# EAGLE design dababa (EAGLE 9.6.2)
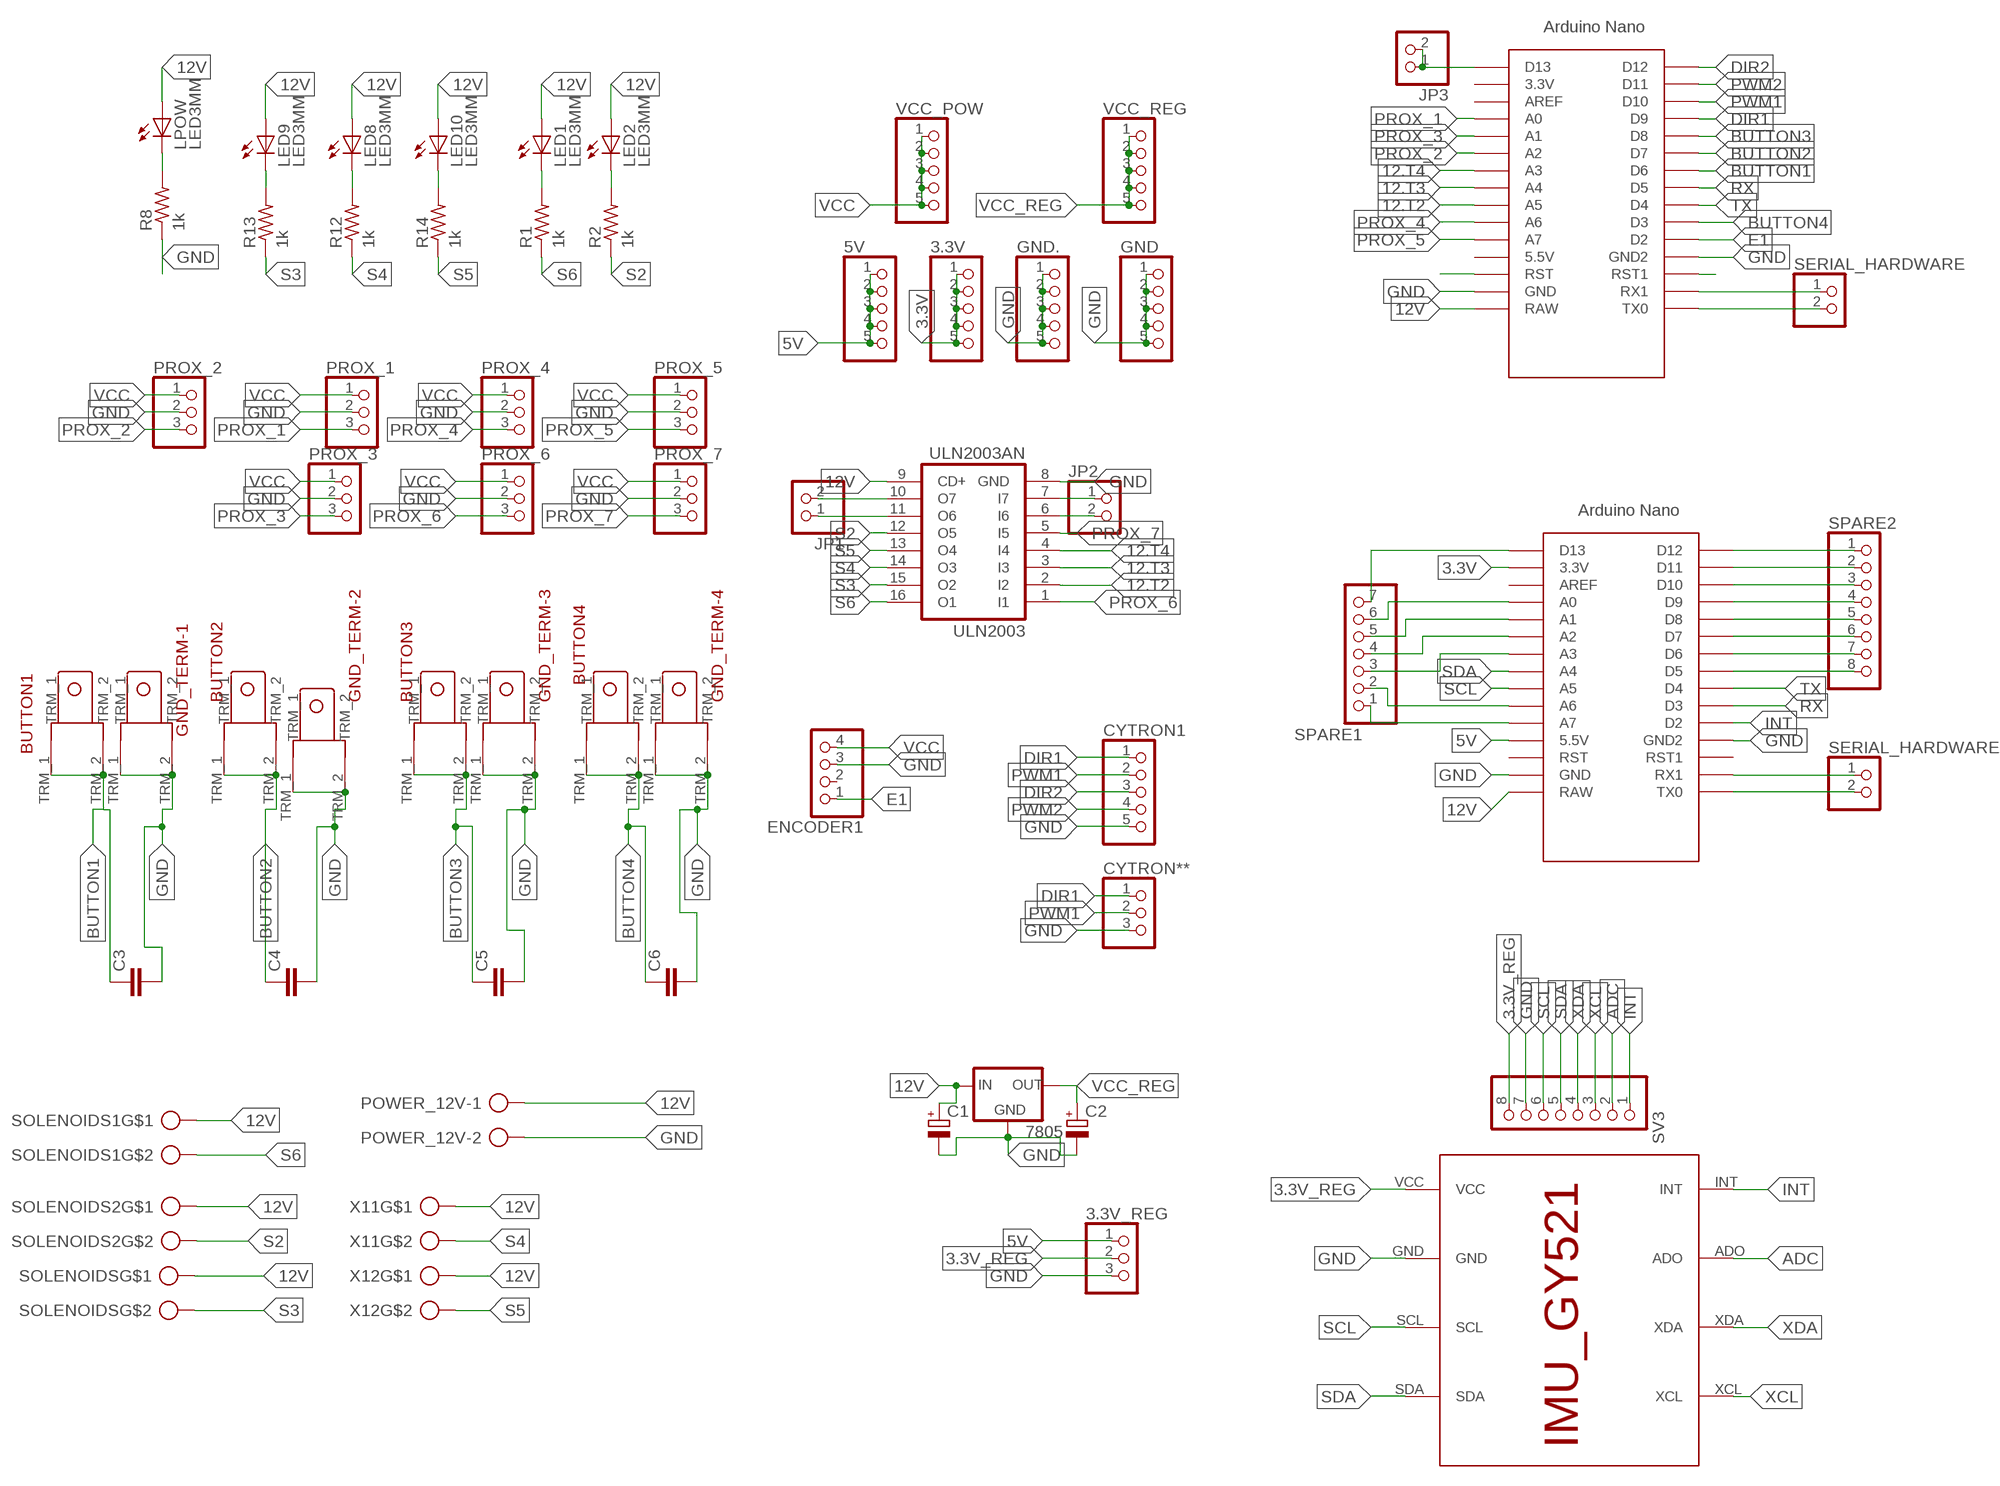
[diagram p0: schematic, sheet 1]

## Parts
3.3V  PINHD-1X5  [1X05]
3.3V_REG  PINHD-1X3  [1X03]
5V  PINHD-1X5  [1X05]
7805  78XXS  [78XXS]
BUTTON1  TERMINAL_EDITED  [TERMINAL_EDITED]
BUTTON2  TERMINAL_EDITED  [TERMINAL_EDITED]
BUTTON3  TERMINAL_EDITED  [TERMINAL_EDITED]
BUTTON4  TERMINAL_EDITED  [TERMINAL_EDITED]
C1  CAP_POL  [E3,5-8]
C2  CAP_POL  [E3,5-8]
C3  CAPACITOR  [C025-025X050]
C4  CAPACITOR  [C025-025X050]
C5  CAPACITOR  [C025-025X050]
C6  CAPACITOR  [C025-025X050]
CYTRON1  PINHD-1X5  [1X05]
CYTRON**  PINHD-1X3  [1X03]
ENCODER1  PINHD-1X4  [1X04]
GND  PINHD-1X5  [1X05]
GND.  PINHD-1X5  [1X05]
GND_TERM-1  TERMINAL_EDITED  [TERMINAL_EDITED]
GND_TERM-2  TERMINAL_EDITED  [TERMINAL_EDITED]
GND_TERM-3  TERMINAL_EDITED  [TERMINAL_EDITED]
GND_TERM-4  TERMINAL_EDITED  [TERMINAL_EDITED]
JP1  PINHD-1X2  [1X02]
JP2  PINHD-1X2  [1X02]
JP3  PINHD-1X2  [1X02]
LED1  LED3MM  [LED3MM]
LED2  LED3MM  [LED3MM]
LED8  LED3MM  [LED3MM]
LED9  LED3MM  [LED3MM]
LED10  LED3MM  [LED3MM]
LPOW  LED3MM  [LED3MM]
POWER_12V  ROSTA.POWER  [W239-302]
PROX_1  PINHD-1X3  [1X03]
PROX_2  PINHD-1X3  [1X03]
PROX_3  PINHD-1X3  [1X03]
PROX_4  PINHD-1X3  [1X03]
PROX_5  PINHD-1X3  [1X03]
PROX_6  PINHD-1X3  [1X03]
PROX_7  PINHD-1X3  [1X03]
R1  1k  RES-5  [0204/5]
R2  1k  RES-5  [0204/5]
R8  1k  RES-5  [0204/5]
R12  1k  RES-5  [0204/5]
R13  1k  RES-5  [0204/5]
R14  1k  RES-5  [0204/5]
SERIAL_HARDWARE  PINHD-1X2  [1X02]
SERIAL_HARDWARE1  PINHD-1X2  [1X02]
SOLENOIDS  CON_PTR_2  [AK300/2]
SOLENOIDS1  CON_PTR_2  [AK300/2]
SOLENOIDS2  CON_PTR_2  [AK300/2]
SPARE1  PINHD-1X7  [1X07]
SPARE2  PINHD-1X8  [1X08]
SV3  PINHD-1X8  [1X08]
U$1  ARDUINO_NANO  [NANO]
U$2  IMU_ROBOCON_GY521  [IMU_GY521]
U$4  ARDUINO_NANO  [NANO]
ULN2003  ULN2003AN  [DIL16]
VCC_POW  PINHD-1X5  [1X05]
VCC_REG  PINHD-1X5  [1X05]
X11  CON_PTR_2  [AK300/2]
X12  CON_PTR_2  [AK300/2]

## Nets
3.3V: 3.3V.1 3.3V.2 3.3V.3 3.3V.4 3.3V.5 U$4.3.3V
3.3V_REG: 3.3V_REG.2 SV3.8 U$2.VCC
5V: 3.3V_REG.1 5V.1 5V.2 5V.3 5V.4 5V.5 U$4.5V(5.5V)
12.T2: U$1.A5 ULN2003.2(I2)
12.T3: U$1.A4 ULN2003.3(I3)
12.T4: U$1.A3 ULN2003.4(I4)
12V: 7805.IN C1.+ LED1.A LED2.A LED8.A LED9.A LED10.A LPOW.A POWER_12V.1 SOLENOIDS1.1 SOLENOIDS2.1 SOLENOIDS.1 U$1.RAW U$4.RAW ULN2003.9(CD+) X11.1 X12.1
ADC: SV3.2 U$2.ADO
BUTTON1: BUTTON1.TRM_1 BUTTON1.TRM_2 C3.1 U$1.D6
BUTTON2: BUTTON2.TRM_1 BUTTON2.TRM_2 C4.1 U$1.D7
BUTTON3: BUTTON3.TRM_1 BUTTON3.TRM_2 C5.1 U$1.D8
BUTTON4: BUTTON4.TRM_1 BUTTON4.TRM_2 C6.1 U$1.D3
DIR1: CYTRON1.1 CYTRON**.1 U$1.D9
DIR2: CYTRON1.3 U$1.D12
E1: ENCODER1.1 U$1.D2
GND: 3.3V_REG.3 7805.GND C1.- C2.- C3.2 C4.2 C5.2 C6.2 CYTRON1.5 CYTRON**.3 ENCODER1.3 GND.1 GND.2 GND.3 GND.4 GND.5 GND..1 GND..2 GND..3 GND..4 GND..5 GND_TERM-1.TRM_1 GND_TERM-1.TRM_2 GND_TERM-2.TRM_1 GND_TERM-2.TRM_2 GND_TERM-3.TRM_1 GND_TERM-3.TRM_2 GND_TERM-4.TRM_1 GND_TERM-4.TRM_2 POWER_12V.2 PROX_1.2 PROX_2.2 PROX_3.2 PROX_4.2 PROX_5.2 PROX_6.2 PROX_7.2 R8.1 SV3.7 U$1.GND U$1.GND1(GND2) U$2.GND U$4.GND U$4.GND1(GND2) ULN2003.8(GND)
INT: SV3.1 U$2.INT U$4.D2
N$1: SERIAL_HARDWARE.1 U$1.RX1
N$2: SERIAL_HARDWARE.2 U$1.TX0
N$4: LED1.K(C) R1.2
N$5: LED2.K(C) R2.2
N$7: JP1.1 ULN2003.11(O6)
N$8: JP1.2 ULN2003.10(O7)
N$9: JP2.1 ULN2003.7(I7)
N$10: JP2.2 ULN2003.6(I6)
N$11: LPOW.K(C) R8.2
N$12: LED8.K(C) R12.2
N$13: U$1.RST1
N$15: JP3.1 JP3.2 U$1.D13
N$16: LED9.K(C) R13.2
N$19: LED10.K(C) R14.2
N$21: SERIAL_HARDWARE1.1 U$4.RX1
N$28: U$1.RST
N$33: SERIAL_HARDWARE1.2 U$4.TX0
N$39: SPARE1.3 U$4.A3
N$42: SPARE1.1 U$4.A7
N$43: SPARE1.2 U$4.A6
N$47: SPARE1.4 U$4.A2
N$48: SPARE1.5 U$4.A1
N$49: SPARE1.6 U$4.A0
N$52: SPARE1.7 U$4.D13
N$53: SPARE2.1 U$4.D12
N$54: SPARE2.2 U$4.D11
N$55: SPARE2.3 U$4.D10
N$56: SPARE2.4 U$4.D9
N$57: SPARE2.5 U$4.D8
N$58: SPARE2.6 U$4.D7
N$59: SPARE2.7 U$4.D6
N$60: SPARE2.8 U$4.D5
PROX_1: PROX_1.3 U$1.A0
PROX_2: PROX_2.3 U$1.A2
PROX_3: PROX_3.3 U$1.A1
PROX_4: PROX_4.3 U$1.A6
PROX_5: PROX_5.3 U$1.A7
PROX_6: PROX_6.3 ULN2003.1(I1)
PROX_7: PROX_7.3 ULN2003.5(I5)
PWM1: CYTRON1.2 CYTRON**.2 U$1.D10
PWM2: CYTRON1.4 U$1.D11
RX: U$1.D5 U$4.D3
S2: R2.1 SOLENOIDS2.2 ULN2003.12(O5)
S3: R13.1 SOLENOIDS.2 ULN2003.15(O2)
S4: R12.1 ULN2003.14(O3) X11.2
S5: R14.1 ULN2003.13(O4) X12.2
S6: R1.1 SOLENOIDS1.2 ULN2003.16(O1)
SCL: SV3.6 U$2.SCL U$4.A5
SDA: SV3.5 U$2.SDA U$4.A4
TX: U$1.D4 U$4.D4
VCC: ENCODER1.4 PROX_1.1 PROX_2.1 PROX_3.1 PROX_4.1 PROX_5.1 PROX_6.1 PROX_7.1 VCC_POW.1 VCC_POW.2 VCC_POW.3 VCC_POW.4 VCC_POW.5
VCC_REG: 7805.OUT C2.+ VCC_REG.1 VCC_REG.2 VCC_REG.3 VCC_REG.4 VCC_REG.5
XCL: SV3.3 U$2.XCL
XDA: SV3.4 U$2.XDA
Unconnected: ENCODER1.2 U$1.3.3V U$1.5V(5.5V) U$1.AREF U$4.AREF U$4.RST U$4.RST1

## Library data of the parts
3.3V 5V CYTRON1 GND GND. VCC_POW VCC_REG = MIA_LIBRARY-2-2-2:PINHD-1X5: PIN HEADER
3.3V_REG CYTRON** PROX_1-PROX_7 = MIA_LIBRARY-2-2-2:PINHD-1X3: PIN HEADER
7805 = MIA_LIBRARY-2-2-2:78XXS: VOLTAGE REGULATOR
BUTTON1-BUTTON4 GND_TERM-1-GND_TERM-4 = MIA_LIBRARY-2-2-2:TERMINAL_EDITED
C1 C2 = MIA_LIBRARY-2-2-2:CAP_POL
C3-C6 = MIA_LIBRARY-2-2-2:CAPACITOR
ENCODER1 = MIA_LIBRARY-2-2-2:PINHD-1X4: PIN HEADER
JP1-JP3 SERIAL_HARDWARE SERIAL_HARDWARE1 = MIA_LIBRARY-2-2-2:PINHD-1X2: PIN HEADER
LED1 LED2 LED8-LED10 LPOW = MIA_LIBRARY-2-2-2:LED3MM
POWER_12V = MIA_LIBRARY-2-2-2:ROSTA.POWER: WAGO SCREW CLAMP; OC_FARNELL: unknown; OC_NEWARK: unknown
R1 R2 R8 R12-R14 = MIA_LIBRARY-2-2-2:RES-5
SOLENOIDS SOLENOIDS1 SOLENOIDS2 X11 X12 = MIA_LIBRARY-2-2-2:CON_PTR_2
SPARE1 = MIA_LIBRARY-2-2-2:PINHD-1X7: PIN HEADER
SPARE2 SV3 = MIA_LIBRARY-2-2-2:PINHD-1X8: PIN HEADER
U$1 U$4 = MIA_LIBRARY-2-2-2:ARDUINO_NANO: Arduino Nano
U$2 = MIA_LIBRARY-2-2-2:IMU_ROBOCON_GY521
ULN2003 = MIA_LIBRARY-2-2-2:ULN2003A: DRIVER ARRAY

## Board
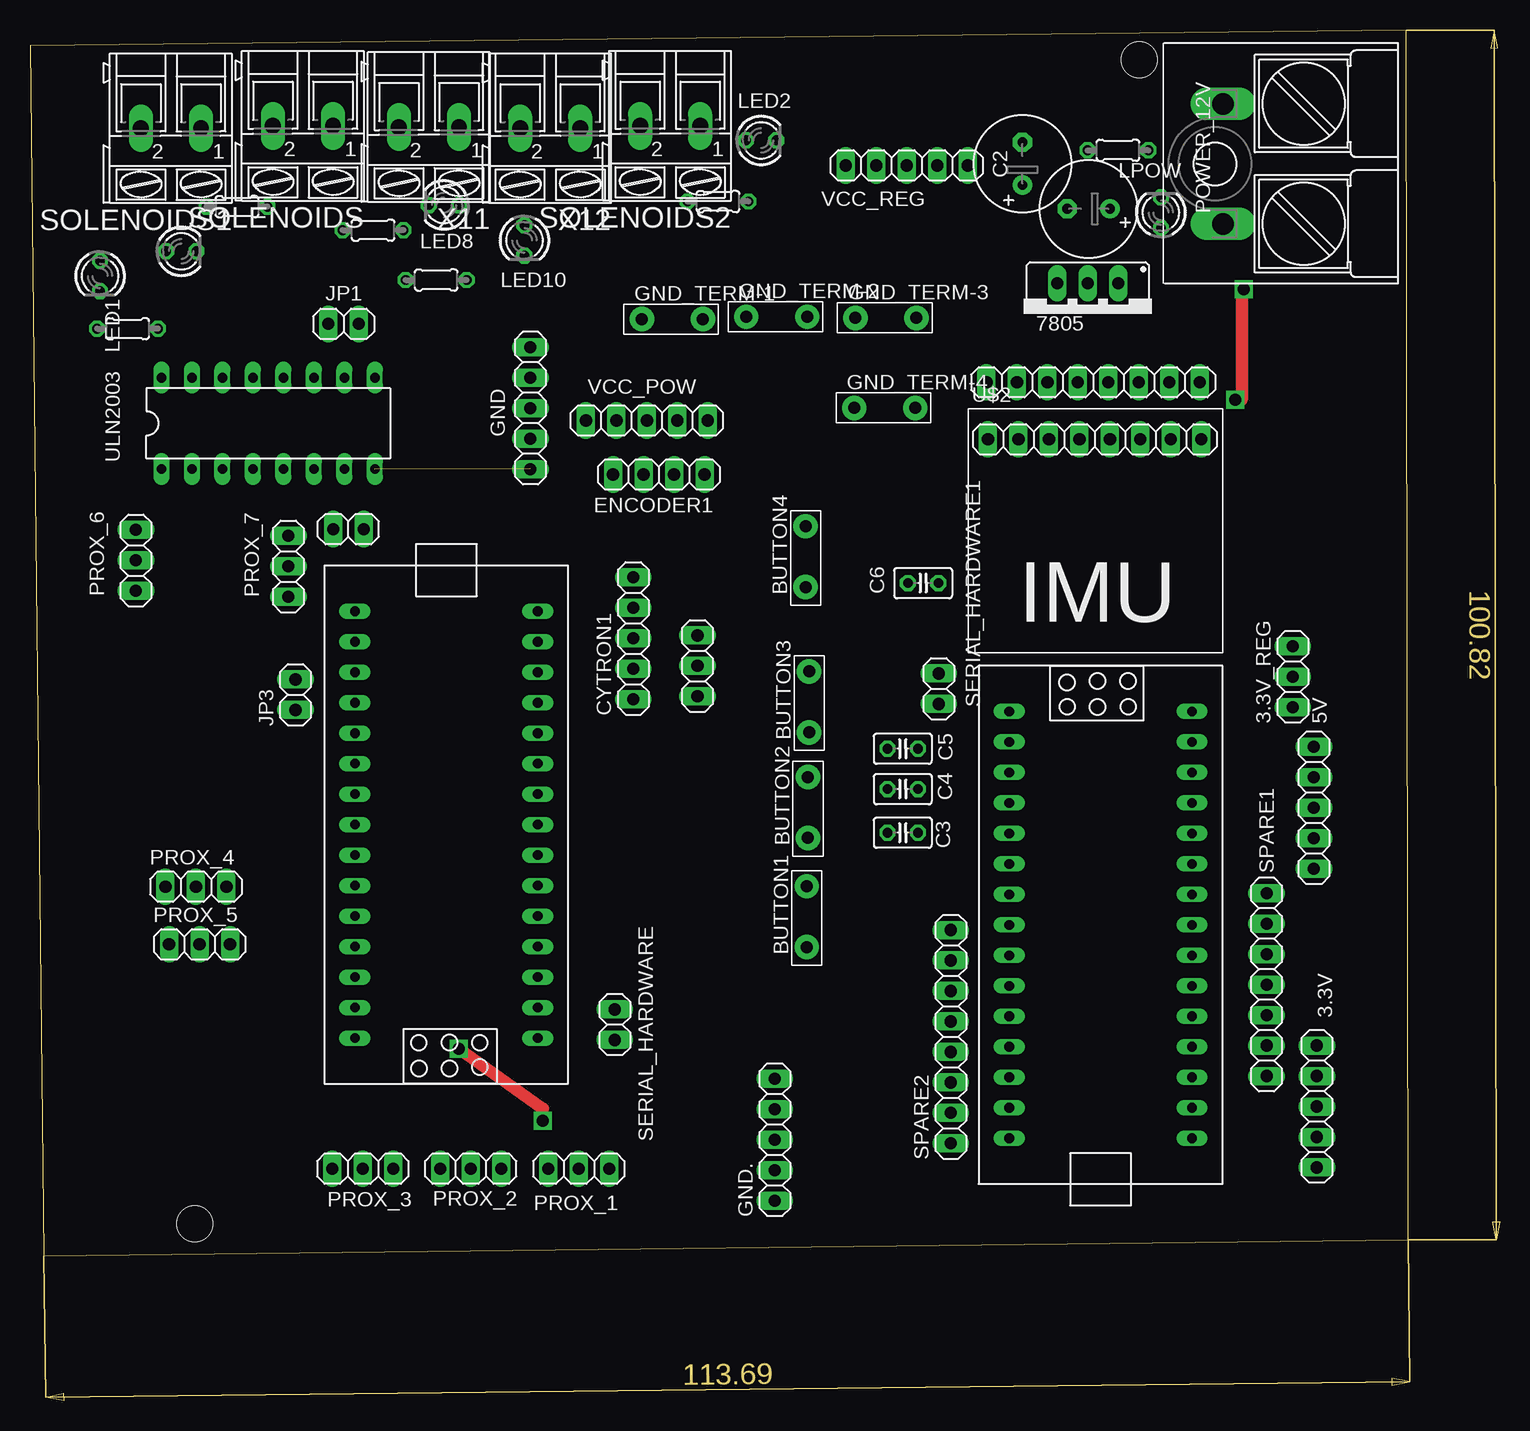
[diagram p1: board, top side]
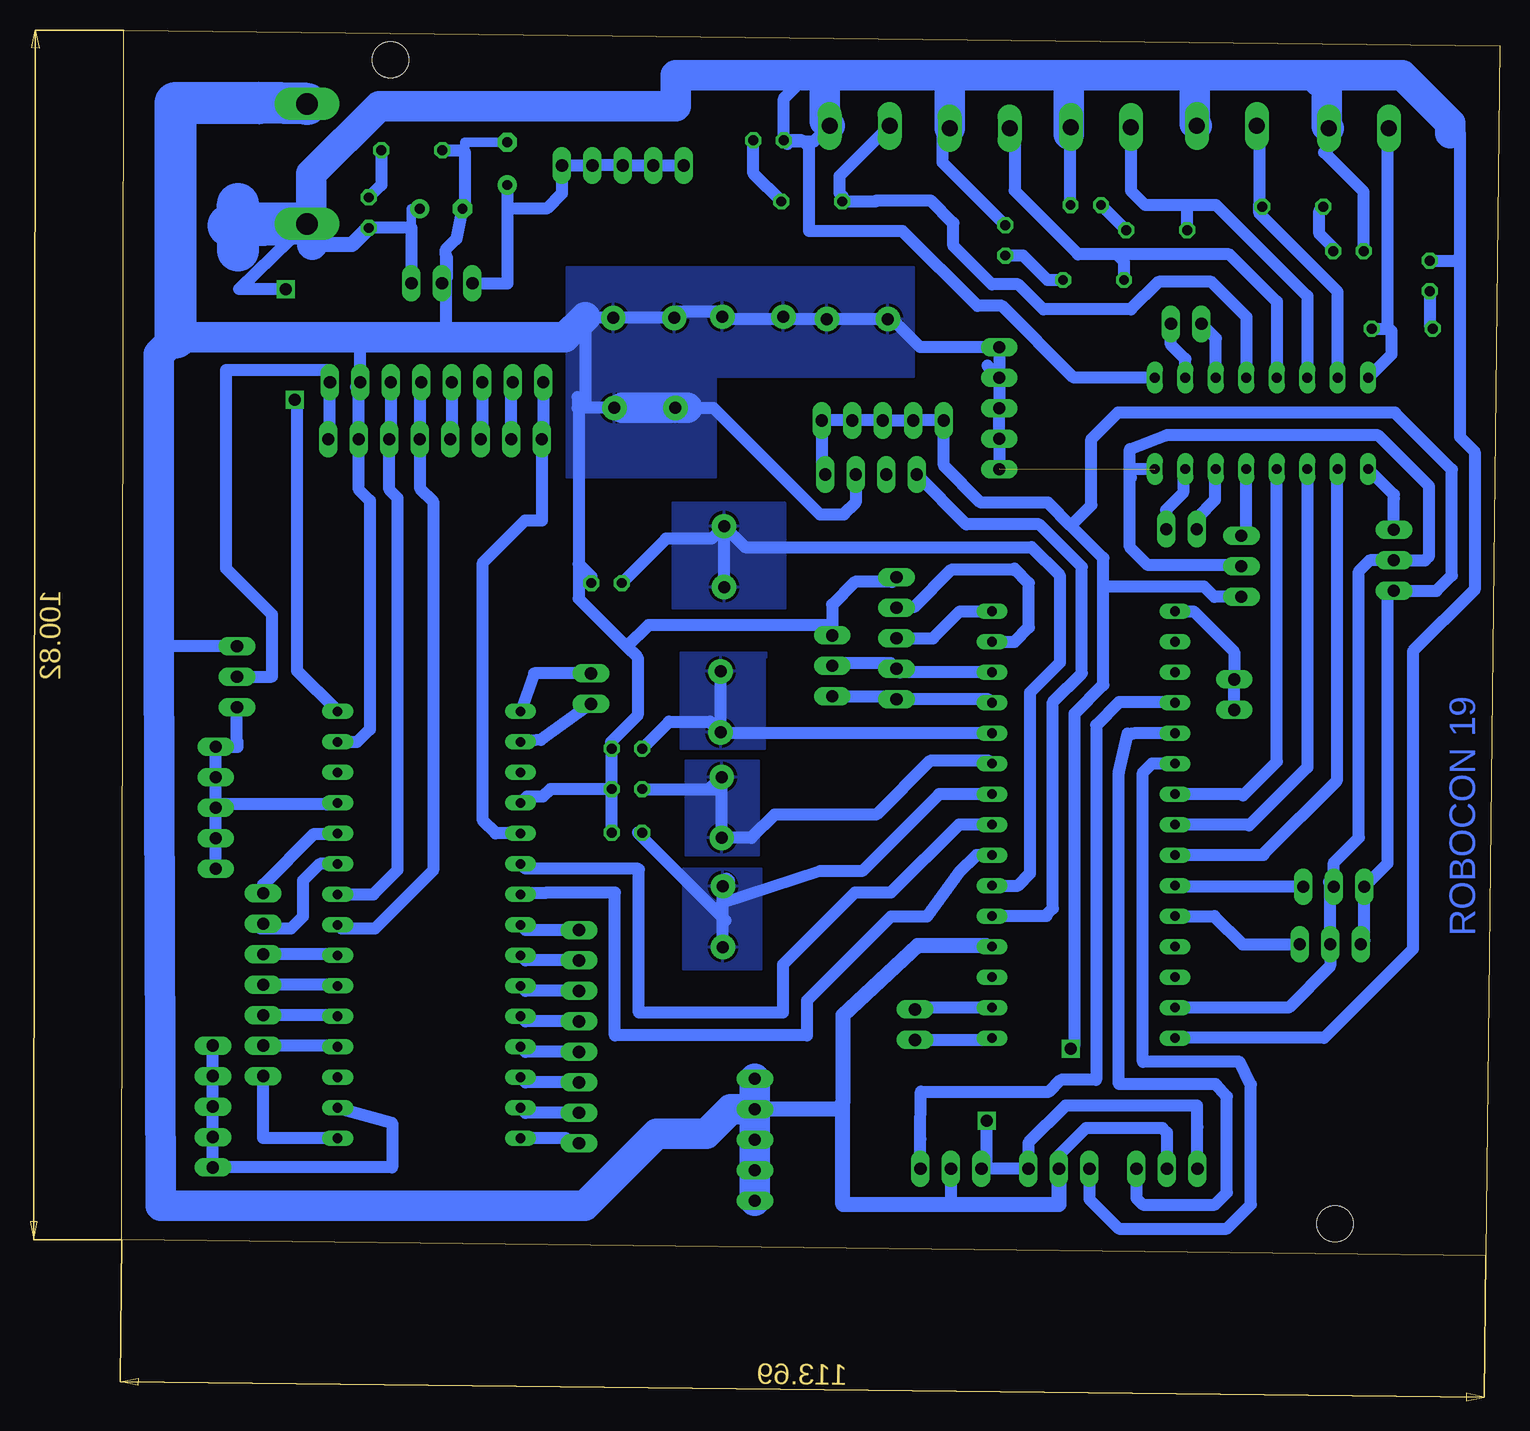
[diagram p2: board, bottom side, seen from below]

Size 114.84 x 102.12 mm. Coordinates in mm from the lower left corner, seen from the top.
Outline: 114.84,1.3 114.68,102.12 0,100.82 1.16,0 114.84,1.3
Copper layers (1*16): Top 0.035mm / dielectric 1.5mm / Bottom 0.035mm
Design rules "default *": minimum track width 0.8mm, minimum drill 0.35mm, track to track 0.8mm, track to pad 0.8mm, pad to pad 6mil, via to via 6mil, smd to smd 6mil, copper to edge 40mil, drill to drill 6mil, minimum pad ring 10mil, minimum via ring 8mil, stop-mask expansion 4mil, vias tented up to drill 0mil, thermal gap 10mil
Holes 3 mm at 13.73,2.64 92.43,99.64

### Footprints (pad centres in the part's own frame; a part is rotated, then mirrored left to right if it is on the bottom)
1X05 = drill 1.016 long: 1 -5.08,0; 2 -2.54,0; 3 0,0; 4 2.54,0; 5 5.08,0
1X03 = drill 1.016 long: 1 -2.54,0; 2 0,0; 3 2.54,0
78XXS = drill 1.016 long: GND 0,-2.54; IN -2.54,-2.54; OUT 2.54,-2.54
TERMINAL_EDITED = drill 1 pad 2.032: TRM_1 -2.54,0; TRM_2 2.54,0
E3,5-8 = drill 0.813 pad 1.6: + -1.778,0 | drill 0.813 pad 1.6 octagon: - 1.778,0
C025-025X050 = drill 0.813 octagon: 1 -1.27,0; 2 1.27,0
1X04 = drill 1.016 long: 1 -3.81,0; 2 -1.27,0; 3 1.27,0; 4 3.81,0
1X02 = drill 1.016 long: 1 -1.27,0; 2 1.27,0
LED3MM = drill 0.813 octagon: A -1.27,0; K 1.27,0
W239-302 = drill 1.8 long: 1 -5,5; 2 5,5
0204/5 = drill 0.813 octagon: 1 -2.54,0; 2 2.54,0
AK300/2 = drill 1.321 long: 1 -2.515,0; 2 2.489,0
1X07 = drill 1.016 long: 1 -7.62,0; 2 -5.08,0; 3 -2.54,0; 4 0,0; 5 2.54,0; 6 5.08,0; 7 7.62,0
1X08 = drill 1.016 long: 1 -8.89,0; 2 -6.35,0; 3 -3.81,0; 4 -1.27,0; 5 1.27,0; 6 3.81,0; 7 6.35,0; 8 8.89,0
NANO = drill 0.8 long: 3.3V -10.16,24.13; 5V -10.16,-1.27; A0 -10.16,19.05; A1 -10.16,16.51; A2 -10.16,13.97; A3 -10.16,11.43; A4 -10.16,8.89; A5 -10.16,6.35; A6 -10.16,3.81; A7 -10.16,1.27; AREF -10.16,21.59; D2 5.08,1.27; D3 5.08,3.81; D4 5.08,6.35; D5 5.08,8.89; D6 5.08,11.43; D7 5.08,13.97; D8 5.08,16.51; D9 5.08,19.05; D10 5.08,21.59; D11 5.08,24.13; D12 5.08,26.67; D13 -10.16,26.67; GND -10.16,-6.35; GND1 5.08,-1.27; RAW -10.16,-8.89; RST -10.16,-3.81; RST1 5.08,-3.81; RX1 5.08,-6.35; TX0 5.08,-8.89
IMU_GY521 = drill 1.016 long: ADO -6.35,0; GND 6.35,0; INT -8.89,0; SCL 3.81,0; SDA 1.27,0; VCC 8.89,0; XCL -3.81,0; XDA -1.27,0
DIL16 = drill 0.813 long: 1 -8.89,-3.81; 2 -6.35,-3.81; 3 -3.81,-3.81; 4 -1.27,-3.81; 5 1.27,-3.81; 6 3.81,-3.81; 7 6.35,-3.81; 8 8.89,-3.81; 9 8.89,3.81; 10 6.35,3.81; 11 3.81,3.81; 12 1.27,3.81; 13 -1.27,3.81; 14 -3.81,3.81; 15 -6.35,3.81; 16 -8.89,3.81

### Placement (x,y rotation side)
3.3V  107.24,12.42 270 top
3.3V_REG  105.23,48.24 90 top
5V  106.99,37.31 270 top
7805  88.15,78.48 180 top
BUTTON1  64.73,28.24 90 top
BUTTON2  64.83,37.34 90 top
BUTTON3  64.93,46.14 90 top
BUTTON4  64.63,58.24 90 top
C1  88.22,87.23 180 top
C2  82.7,90.99 90 top
C3  72.73,35.24 0 top
C4  72.73,38.88 0 top
C5  72.73,42.24 0 top
C6  74.43,56.04 0 top
CYTRON1  50.27,51.44 90 top
CYTRON**  55.63,49.14 90 top
ENCODER1  52.4,65.09 0 top
GND  41.7,70.62 270 top
GND.  62.07,9.66 90 top
GND_TERM-1  53.53,78.04 0 top
GND_TERM-2  62.23,78.24 0 top
GND_TERM-3  71.33,78.14 0 top
GND_TERM-4  71.23,70.64 0 top
JP1  26.13,77.64 0 top
JP2  26.53,60.54 180 top
JP3  22.13,46.74 90 top
LED1  5.83,81.64 270 top
LED2  60.93,92.94 0 top
LED8  34.5,87.54 180 top
LED9  12.61,83.7 0 top
LED10  41.2,84.6 270 top
LPOW  94.25,86.91 90 top
POWER_12V  104.41,90.98 90 top
PROX_1  45.73,7.24 0 top
PROX_2  36.73,7.24 180 top
PROX_3  27.73,7.24 0 top
PROX_4  13.83,30.74 0 top
PROX_5  14.13,25.94 0 top
PROX_6  8.82,57.93 90 top
PROX_7  21.53,57.44 90 top
R1  8.13,77.24 180 top
R2  57.33,87.84 0 top
R8  90.66,92.11 0 top
R12  28.59,85.45 0 top
R13  17.24,87.41 180 top
R14  33.85,81.3 0 top
SERIAL_HARDWARE  48.73,19.24 270 top
SERIAL_HARDWARE1  75.73,47.24 90 top
SOLENOIDS  22.73,94.14 180 top
SOLENOIDS1  11.73,93.94 180 top
SOLENOIDS2  53.33,94.14 180 top
SPARE1  103.05,22.58 270 top
SPARE2  76.73,18.24 90 top
SV3  88.59,72.78 0 top
U$1  37.23,27.02 0 top
U$2  88.72,68.02 0 top
U$4  86.68,36.45 180 top
ULN2003  19.85,69.35 0 top
VCC_POW  51.41,69.59 180 top
VCC_REG  73.07,90.84 180 top
X11  33.23,94.04 180 top
X12  43.33,93.94 180 top

### Tracks (layer width: path | path; a pad name or v marks a point on that pad's centre or on a via)
3.3V
  Bottom 1: 3.3V.1 3.3V.2 3.3V.3 3.3V.4 3.3V.5 92.3,7.34 92.3,11.05 U$4.3.3V
3.3V_REG
  Bottom 1: 3.3V_REG.2 102.33,48.24 102.33,53.44 106.16,57.27 106.16,73.78 97.48,73.78 SV3.8 97.48,68.15 U$2.VCC
5V
  Bottom 1: 5V.3 5V.4 5V.5 | 5V.3 5V.2 5V.1 | U$4.5V 97.75,37.72 97.75,37.59 106.99,37.59 5V.3 | 5V.1 105.2,42.39 105.21,42.71 105.21,42.94 105.23,42.94 3.3V_REG.1 | 5V.1 105.23,42.39
12.T2
  Bottom 1: U$1.A5 19.68,33.37 19.65,33.47 13.58,39.54 13.58,65.45 ULN2003.2
12.T3
  Bottom 1: U$1.A4 20.87,35.91 20.89,35.84 16.51,40.22 16.04,40.69 ULN2003.3
12.T4
  Bottom 1: U$1.A3 21.64,38.45 21.39,38.35 18.58,41.16 ULN2003.4
12V  (via drill 1)
  Top 1: 101.16,80.74 v101.16,80.54 100.96,80.34 100.96,71.3 v100.43,71.3
  Bottom 0.8: C1.+ 90.69,87.23 90.69,85.64
  Bottom 1: 105.05,86.44 POWER_12V.1 105.05,80.54 v101.16,80.54 | 7805.IN 90.69,85.64 LPOW.A | v100.43,71.3 100.23,71.1 100.23,48.73 U$4.RAW | 3.32,83.24 3.32,93.52 4.13,94.34 | 3.32,83.24 3.32,68.22 2.09,67 2.09,55.48 7.23,50.34 7.23,25.54 14.63,18.14 U$1.RAW | LED9.A 11.34,88.65 14.63,91.94 14.24,92.32 SOLENOIDS1.1 | LED1.A 3.65,82.91 3.32,83.24 | 46.41,98.22 46.53,98.34 | LED2.A 59.66,96.41 57.73,98.34 | LED10.A 46.41,91.08 46.41,93.37 X12.1 | 59.34,92.64 59.64,92.94 | 59.64,92.94 58.14,92.94 57.55,92.35 57.55,85.38 49.77,85.38 43.53,79.14 41.46,79.14 35.48,73.16 ULN2003.9 | 59.64,92.94 LED2.A | 99.03,85.9 98.97,85.9 | LED2.A 59.56,92.84 57.15,92.84 SOLENOIDS2.1 | LED8.A 35.77,93.28 35.93,93.44 | X11.1 35.75,98.16 35.93,98.34
  Bottom 1.27: LPOW.A 95.65,84.24 98.97,84.24 | U$1.RAW
  Bottom 2.54: 101.73,85.9 99.03,85.9 99.03,90.14 93.38,95.79 68.68,95.79 68.68,98.34 57.73,98.34 56.23,98.34 | 98.97,85.9 98.97,84.24 | 35.93,98.34 46.53,98.34 | 46.53,98.34 56.23,98.34 | 35.93,98.34 26.03,98.34 | 26.03,98.34 15.53,98.34 | 14.43,98.34 8.13,98.34 4.13,94.34 4.13,93.54 | 14.43,98.34 15.53,98.34 | 15.06,97.88 15.53,98.34 | 26.03,98.34 25.43,97.73 25.43,94.32 SOLENOIDS.1 | 35.93,93.44 35.93,98.34 | 14.43,98.34 14.43,94.12 SOLENOIDS1.1 | SOLENOIDS2.1 56.23,94.52 56.23,98.34 | X12.1 45.84,97.66 46.53,98.34
  Bottom 3.5: POWER_12V.1 105.15,85.8 105.15,83.74 | POWER_12V.1 105.15,86 105.15,87.64 | POWER_12V.1 101.73,85.9 | POWER_12V.1 105.89,85.9 105.95,85.84
ADC
  Bottom 1: U$2.ADO 82.37,72.65 SV3.2
BUTTON1
  Bottom 1: 64.83,29.24 64.74,29.27 64.83,29.36 56.66,32.04 53.13,32.04 46.72,38.45 U$1.D6 | 64.53,27.94 71.83,35.24 C3.1 | BUTTON1.TRM_1 64.73,30.74 | 64.73,30.74 64.23,31.24 64.43,31.44 64.73,31.14 BUTTON1.TRM_2 64.73,30.74
  pour Bottom: 61.53,32.24 61.53,23.84 68.03,23.84 68.03,32.24
BUTTON2
  Bottom 1: C4.1 65.73,38.88 | 65.73,38.88 64.94,38.88 | U$1.D7 42.55,41.23 47.49,41.23 51.98,36.74 60.43,36.74 62.37,34.8 BUTTON2.TRM_1 BUTTON2.TRM_2 65.73,38.98 65.73,38.88
  pour Bottom: 61.73,41.24 61.73,33.34 67.03,33.34 67.83,33.34 67.83,41.24
BUTTON3
  Bottom 1: C5.1 69.21,44.49 65.82,44.49 BUTTON3.TRM_1 BUTTON3.TRM_2 | U$1.D8 64.23,43.53
  pour Bottom: 61.23,49.84 61.23,42.24 68.23,42.24 68.23,50.24 61.13,50.24 61.13,49.84
BUTTON4
  Bottom 1: U$1.D3 40.14,30.83 39.13,31.84 39.13,46.94 36.63,49.44 36.63,56.64 39.03,59.04 62.89,59.04 BUTTON4.TRM_2 | C6.1 69.46,59.74 65.67,59.74 BUTTON4.TRM_2 | BUTTON4.TRM_1 BUTTON4.TRM_2
  pour Bottom: 59.53,62.54 59.53,53.94 59.83,53.94 68.93,53.94 68.93,54.04 68.93,62.74 68.83,62.74 59.53,62.74
DIR1
  Bottom 1: U$1.D9 42.6,46.36 CYTRON1.1 50.51,46.6 CYTRON**.1
DIR2
  Bottom 1: CYTRON1.3 47.23,51.44 44.98,53.69 U$1.D12
E1
  Bottom 1: U$1.D2 37.78,28.29 37.78,28.39 37.23,28.94 37.23,46.14 34.83,48.54 34.83,57.39 38.38,60.94 44.44,60.94 ENCODER1.1
GND  (1 unrouted)
  Bottom 0.8: C2.- 86.24,92.77 86.24,91.93
  Bottom 1: GND.2 GND.1 48.3,75.7 50.69,78.09 | GND.2 GND.3 GND.4 GND.5 41.68,65.56 | SV3.7 95.07,72.65 | PROX_3.2 27.73,10.24 28.11,10.62 34.48,10.62 36.73,8.38 PROX_2.2 | 42.8,25.86 U$1.GND1 | PROX_1.2 45.73,4.24 | R8.1 86.42,92.11 86.24,91.93 86.24,87.43 C1.- 86.95,84.72 87.83,83.84 87.83,83.34 | GND.2 42.7,74.16 | 87.83,83.34 87.83,76.51 | 7805.GND 87.75,81.42 87.75,83.26 87.83,83.34 | C3.2 C4.2 | C4.2 C5.2 74.06,42.8 71.85,45.01 71.85,49.84 72.74,50.73 | C4.2 79.09,38.88 79.73,38.24 81.08,38.24 U$4.GND1 | 76.85,71.54 76.85,70.65 76.75,70.65 | 76.75,70.65 76.75,57.64 | 76.75,57.64 76.75,54.74 72.74,50.73 | SV3.7 95.33,72.39 95.07,72.14 U$2.GND 95.07,63.82 94.16,62.91 94.16,43.85 95.21,42.8 U$4.GND | 54.73,12.84 55.37,12.2 | SV3.7 94.95,76.51 | 3.3V_REG.3 111.69,50.78 111.75,50.84 | CYTRON1.5 50.65,56.14 53.73,56.14 55.63,54.24 55.63,52.54 | 55.63,52.54 CYTRON**.3 | C6.2 75.7,56.59 76.75,57.64 | 55.63,52.54 70.93,52.54 72.74,50.73 | ENCODER1.3 53.67,62.75 54.66,61.77 56.66,61.77 65.53,70.64 GND_TERM-4.TRM_1 | 14.13,31.04 PROX_5.2 14.13,24.14 17.6,20.67 U$1.GND | 14.13,31.04 14.23,31.14 | 14.13,31.04 PROX_4.2 13.83,32.74 11.75,34.82 11.75,57.02 10.84,57.93 PROX_6.2 6.24,57.93 5.88,58.29 5.88,64.09 10.13,68.34 27.83,68.34 30.83,67.21 30.83,64.74 | 71.22,70.65 76.75,70.65 | 76.75,70.65 76.21,71.19 76.21,78.2 76.15,78.14 GND_TERM-3.TRM_2 GND_TERM-3.TRM_1 68.79,78.58 68.73,78.64 65.17,78.64 GND_TERM-2.TRM_2 64.57,78.04 GND_TERM-1.TRM_2 GND_TERM-1.TRM_1 | PROX_7.2 21.63,57.54 29.33,57.54 30.83,59.04 30.83,64.74 | ULN2003.8 30.53,65.54 30.73,65.34 30.73,64.84 30.83,64.74
  Bottom 1.27: PROX_2.2 36.73,4.24 45.73,4.24 54.73,4.24 54.73,12.84 54.73,20.04 48.52,25.86 42.8,25.86 | 55.37,12.2 GND..4
  Bottom 2.54: GND..5 GND..4 | GND..4 GND..3 GND..2 GND..1 | GND..4 64.07,12.2 66.13,10.14 70.23,10.14 76.23,4.14 111.59,4.14 111.75,50.84 111.75,75.13 110.37,76.51 94.95,76.51 87.83,76.51 77.9,76.51 76.21,78.2 | 73.12,70.65 71.22,70.65 67.72,70.65
  Bottom 3.5: POWER_12V.2 103.45,96.06 103.43,96.04 | 103.43,96.04 103.33,96.04 | 103.43,96.04 110.37,96.04 110.37,76.51
  pour Bottom: 48.83,82.34 77.73,82.34 77.73,64.84 65.33,64.84 65.33,73.24 48.83,73.24
INT
  Bottom 1: U$4.D2 83.67,35.18 84.73,36.24 84.73,57.74 81.23,61.24 79.83,61.24 U$2.INT 79.7,68.15 | SV3.1 79.7,70.24 79.7,68.15 | 79.7,68.15 79.7,68.14
N$1
  Bottom 1: U$1.RX1 48.57,20.67 SERIAL_HARDWARE.1
N$2
  Bottom 1: U$1.TX0 42.31,18 48.7,18 SERIAL_HARDWARE.2 48.73,18.02 48.62,18.13
N$4
  Bottom 1: LED1.K 5.83,77.48 R1.2
N$5
  Bottom 1: R2.2 62.2,90.17 LED2.K
N$7
  Bottom 1: ULN2003.11 23.66,76.44 JP1.1
N$8
  Bottom 1: ULN2003.10 26.2,74.71 27.4,75.91 JP1.2
N$9
  Bottom 1: ULN2003.7 26.38,65.36 26.38,63.57 27.8,62.15 JP2.1
N$10
  Bottom 1: ULN2003.6 23.74,65.46 23.74,62.97 25.26,61.45 JP2.2
N$11
  Bottom 1: LPOW.K 93.2,89.23 R8.2
N$12
  Bottom 1: R12.2 LED8.K
N$15
  Bottom 1: U$1.D13 25.51,53.69 22.13,50.31 JP3.2 JP3.1
N$16
  Bottom 1: LED9.K 13.88,83.99 15.03,85.14 15.03,87.08 R13.2
N$19
  Bottom 1: R14.2 37.69,81.3 39.72,83.33 LED10.K
N$21
  Bottom 1: SERIAL_HARDWARE1.1 79.91,42.97 U$4.RX1
N$33
  Bottom 1: SERIAL_HARDWARE1.2 80.47,48.51 U$4.TX0
N$39
  Bottom 1: U$4.A3 96.94,25.12 SPARE1.3
N$42
  Bottom 1: SPARE1.1 103.05,30.92 98.83,35.14 96.88,35.14 U$4.A7
N$43
  Bottom 1: U$4.A6 98.33,32.64 99.73,31.24 99.73,28.24 100.73,27.24 103.27,27.24 103.27,27.66 SPARE1.2
N$47
  Bottom 1: U$4.A2 96.94,22.58 SPARE1.4
N$48
  Bottom 1: U$4.A1 96.94,20.04 SPARE1.5
N$49
  Bottom 1: U$4.A0 96.94,17.5 SPARE1.6
N$52
  Bottom 1: U$4.D13 103.05,9.78 SPARE1.7
N$53
  Bottom 1: U$4.D12 77.87,9.78 SPARE2.1
N$54
  Bottom 1: SPARE2.2 81.17,11.89 U$4.D11
N$55
  Bottom 1: SPARE2.3 81.17,14.43 U$4.D10
N$56
  Bottom 1: SPARE2.4 81.17,16.97 U$4.D9
N$57
  Bottom 1: SPARE2.5 81.17,19.51 U$4.D8
N$58
  Bottom 1: SPARE2.6 81.17,22.05 U$4.D7
N$59
  Bottom 1: SPARE2.7 81.17,24.59 U$4.D6
N$60
  Bottom 1: SPARE2.8 81.17,27.13 U$4.D5
PROX_1
  Bottom 1: PROX_1.3 48.27,9.7 48.24,13.67 37.55,13.67 36.58,14.64 33.63,14.64 33.63,44.21 31.73,46.11 27.86,46.11 27.56,46.07 U$1.A0
PROX_2
  Bottom 1: PROX_2.3 34.19,4.7 31.73,2.24 22.73,2.24 20.73,4.24 20.73,14.24 21.68,16.14 29.73,16.14 29.73,40.24 29.11,40.88 28.98,40.99 U$1.A2
PROX_3
  Bottom 1: PROX_3.3 30.27,4.78 29.73,4.24 23.73,4.24 22.73,5.24 22.73,13.24 23.68,14.29 31.73,14.29 31.73,40.24 31,43.49 30.69,43.49 30.37,43.56 30.34,43.53 U$1.A1
PROX_4
  Bottom 1: PROX_4.3 26.98,30.74 U$1.A6
PROX_5
  Bottom 1: U$1.A7 23.78,28.29 21.43,25.94 PROX_5.3
PROX_6
  Bottom 1: 8.82,63.11 PROX_6.3 8.82,63.4 ULN2003.1
PROX_7
  Bottom 1: PROX_7.3 21.12,60.39 ULN2003.5
PWM1
  Bottom 1: U$1.D10 49.98,48.61 CYTRON1.2 50.75,49.38 55.39,49.38 CYTRON**.2
PWM2
  Bottom 1: CYTRON1.4 50.21,54.04 48.83,54.04 45.73,57.14 40.53,57.14 40.43,57.24 39.23,56.04 39.23,52.34 40.42,51.15 U$1.D11
RX
  Bottom 1: U$1.D5 45.06,35.91 50.73,30.24 53.73,30.24 59.73,24.24 59.73,20.24 71.73,20.24 71.73,32.19 71.93,32.24 81.2,32.24 U$4.D3
S2
  Bottom 1: SOLENOIDS2.2 55.03,89.95 55.03,88.54 54.79,88.3 R2.1 52.02,87.84 51.92,87.94 47.43,87.94 45.53,86.04 45.53,84.14 42.33,80.94 40.13,80.94 38.03,78.84 30.73,78.84 28.43,81.14 24.03,81.14 21.12,78.23 ULN2003.12
S3
  Bottom 1: 20.03,87.66 20.03,86.84 13.5,80.31 ULN2003.15 | R13.1 20.03,87.66 | 20.03,87.66 20.03,93.15 20.24,93.36 SOLENOIDS.2
S4
  Bottom 1: 26.13,87.54 23.63,87.54 16.04,79.95 ULN2003.14 | 26.13,87.54 29.53,87.54 30.74,88.75 X11.2 | R12.1 26.05,87.46 26.13,87.54
S5
  Bottom 1: 31.93,83.44 22.53,83.44 18.58,79.49 ULN2003.13 | 31.93,83.44 35.13,83.44 40.43,88.74 40.43,92.83 40.84,93.24 X12.2 | R14.1 31.31,82.82 31.93,83.44
S6
  Bottom 1: R1.1 9.22,77.24 | 9.22,77.24 9.02,77.04 9.02,75.1 ULN2003.16 | SOLENOIDS1.2 9.38,93.8 9.38,77.4 9.22,77.24
SCL
  Bottom 1: U$4.A5 93.87,30.1 91.84,32.13 91.84,63.13 92.53,63.83 U$2.SCL 92.41,68.15 SV3.6
SDA
  Bottom 1: U$4.A4 96.52,27.24 93.73,27.24 88.87,32.1 88.87,62.84 89.99,63.96 U$2.SDA 89.99,72.65 SV3.5
TX
  Bottom 1: U$1.D4 43.6,33.37 45.09,31.89 47.73,28.24 50.73,28.24 57.73,21.24 57.73,18.34 73.73,18.34 73.73,30.24 79.43,30.24 81.54,30.24 | 81.54,30.24 81.68,30.24 | U$4.D4 81.68,30.1 81.54,30.24
VCC  (via drill 1)
  Top 1: v42.73,11.24 42.73,12.24 v35.73,17.24
  Bottom 1: PROX_1.1 42.73,7.24 | PROX_3.1 25.19,10.7 25.22,12.49 36.18,12.49 39.27,9.4 PROX_2.1 42.73,7.24 | 42.73,7.24 v42.73,11.24 | v35.73,17.24 35.43,17.54 35.43,45.16 33.03,47.56 33.03,55.74 | 35.73,60.84 33.03,58.13 33.03,55.74 | 35.73,60.84 37.64,62.74 43.23,62.74 46.33,65.84 VCC_POW.5 VCC_POW.4 VCC_POW.3 VCC_POW.2 VCC_POW.1 56.49,65.37 ENCODER1.4 | PROX_5.1 11.29,26.24 PROX_4.1 9.37,32.66 9.37,54.84 PROX_6.1 5.28,55.39 3.98,56.69 3.98,65.49 8.73,70.24 31.83,70.24 34.03,68.04 34.03,62.54 35.73,60.84 | PROX_7.1 23.79,54.9 24.63,55.74 33.03,55.74
VCC_REG
  Bottom 1: C2.+ 82.7,87.24 | 82.7,87.24 82.7,81.02 7805.OUT | VCC_REG.5 VCC_REG.4 VCC_REG.3 VCC_REG.2 VCC_REG.1 78.15,88.52 79.43,87.24 82.7,87.24
XCL
  Bottom 1: SV3.3 84.78,68.15 U$2.XCL
XDA
  Bottom 1: SV3.4 87.33,68.15 U$2.XDA

### Text on the board
Bottom: ROBOCON 19